# Altium schematic sheet RF.SchDoc
size A
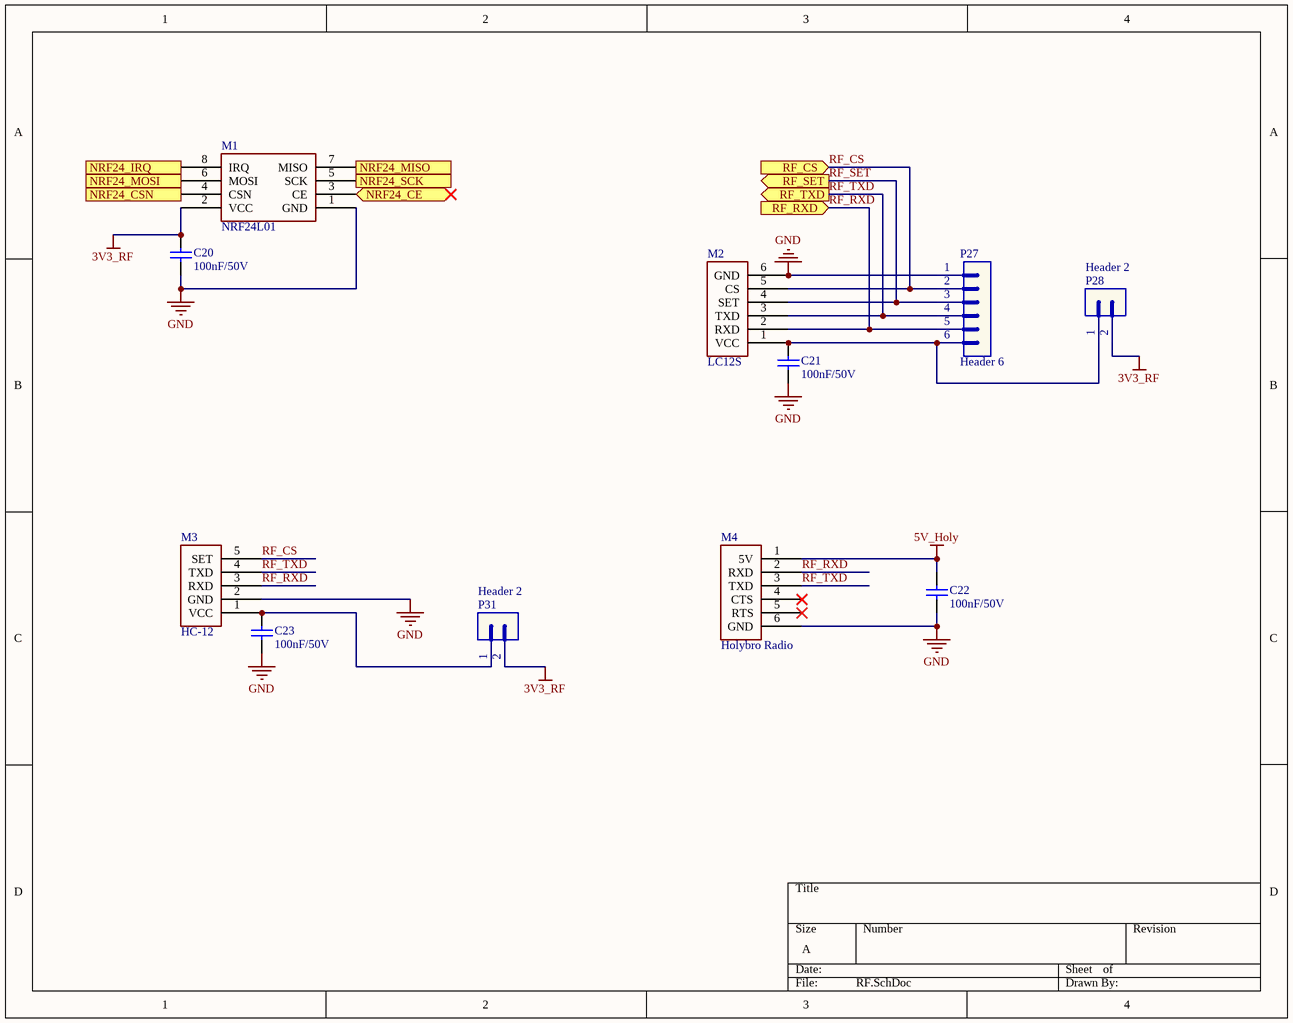
[diagram p0: RF.SchDoc]

## Parts
C20  value 100nF/50V  [CAP-SM-0805]  (hidden comment: Cap-100nF-50V-0805)
C21  value 100nF/50V  [CAP-SM-0805]  (hidden comment: Cap-100nF-50V-0805)
C22  value 100nF/50V  [CAP-SM-0805]  (hidden comment: Cap-100nF-50V-0805)
C23  value 100nF/50V  [CAP-SM-0805]  (hidden comment: Cap-100nF-50V-0805)
M1  NRF24L01  [NRF24L01]
M2  LC12S  [LC12S]
M3  HC-12  [HC-12]
M4  Holybro Radio  [Holybro-Radio]
P27  Header 6  [JP6]
P28  Header 2  [JP2]
P31  Header 2  [JP2]

## Ports
NRF24_CE (bidir), NRF24_CSN (in), NRF24_IRQ (out), NRF24_MISO (out), NRF24_MOSI (in), NRF24_SCK (in), RF_CS (in), RF_RXD (in), RF_SET (out), RF_TXD (out)

## Nets
3V3_RF: C20.2 M1.2(VCC) P28.2 P31.2
5V_Holy: C22.2 M4.1(5V)
GND: C20.1 C21.1 C22.1 C23.1 M1.1(GND) M2.6(GND) M3.2(GND) M4.6(GND) P27.1
NRF24_CE: M1.3(CE) ; port NRF24_CE
NRF24_CSN: M1.4(CSN) ; port NRF24_CSN
NRF24_IRQ: M1.8(IRQ) ; port NRF24_IRQ
NRF24_MISO: M1.7(MISO) ; port NRF24_MISO
NRF24_MOSI: M1.6(MOSI) ; port NRF24_MOSI
NRF24_SCK: M1.5(SCK) ; port NRF24_SCK
RF_CS: M2.5(CS) M3.5(SET) P27.2 ; port RF_CS
RF_RXD: M2.2(RXD) M3.3(RXD) M4.2(RXD) P27.5 ; port RF_RXD
RF_SET: M2.4(SET) P27.3 ; port RF_SET
RF_TXD: M2.3(TXD) M3.4(TXD) M4.3(TXD) P27.4 ; port RF_TXD
NetC21_2: C21.2 M2.1(VCC) P27.6 P28.1
NetC23_2: C23.2 M3.1(VCC) P31.1

Not connected (* = marked no-connect by the designer): M4 4(CTS)* 5(RTS)*

## Library data of the parts
C20-C23 = Cap-100nF-50V-0805: CAP CER 0.1UF 50V Y5V 0805; Manufacturer: Samsung Electro-Mechanics; Manufacturer Part Number: CL21F104ZBCNNNC; Local Supplier: thegioiic; Local Supplier Link: https://thegioiic.com/products/tu-100nf-0-1uf-50v-0805; Supplier 1: Digikey; Supplier 1 Part Number: 1276-1007-1-ND; Supplier 1 Link: https://www.digikey.com/product-detail/en/samsung-electro-mechanics/CL21F104ZBCNNNC/1276-1007-1-ND/3889093
P27 = Header 6: Header, 6-Pin; LatestRevisionDate: 17-Jul-2002; LatestRevisionNote: Re-released for DXP Platform.; Publisher: Altium Limited
P28 P31 = Header 2: Header, 2-Pin; LatestRevisionDate: 17-Jul-2002; LatestRevisionNote: Re-released for DXP Platform.; Publisher: Altium Limited
M1 = NRF24L01: Local Supplier Link: https://hshop.vn/products/mach-thu-phat-nrf24l01-pa-2-4ghzcu-khech-dai-cung-suat-thu-phat; Local Supplier: HShop; Local Supplier Part Number: HS000888; Manufacturer: *; Manufacturer Part Number: *
M2 = LC12S: Local Supplier Link: https://hshop.vn/products/mach-thu-phat-rf-uart-lc12s-2-4ghz?fbclid=IwAR3h1hU0io-Cc4GBL9Q-KMB_-TKtvE-b63OAEmRNHthVrXHliy_JpDId3Yg; Local Supplier: HShop; Local Supplier Part Number: HS00095; Manufacturer: *; Manufacturer Part Number: *
M3 = HC-12: Local Supplier: HShop; Local Supplier Link: https://hshop.vn/products/mach-thu-phat-rf-uart-si4463-433mhzkhoang-coch-1km; Local Supplier Part Number: HS000897; Manufacturer: *; Manufacturer Part Number: *
M4 = Holybro Radio: Local Supplier: *; Local Supplier Link: https://www.lazada.vn/products/ld-holybro-433mhz-915-mhz-500-mw-thu-phat-vo-tuyen-xa-bo-v3-cho-pixhawk-4-dieu-khien-chuyen-bay-i430804435-s768474304.html?spm=a2o4n.searchlist.list.4.25396b19yIS9XO&search=1; Local Supplier Part Number: *; Manufacturer: *; Manufacturer Part Number: *